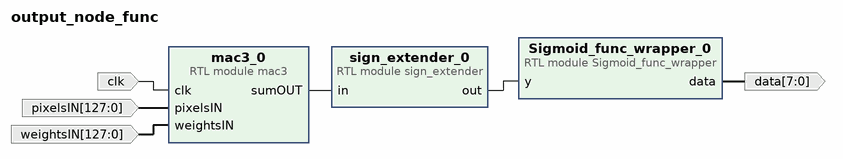
[diagram p0: block diagram of the top level]
# Vivado block design output_node_func, xc7a35tcpg236-1, Vivado 2022.2
create_bd_design output_node_func

create_bd_port -dir I -type clk clk
create_bd_port -dir I -from 127 -to 0 pixelsIN
create_bd_port -dir I -from 127 -to 0 weightsIN
create_bd_port -dir O -from 7 -to 0 data

create_bd_cell -type module -reference sign_extender sign_extender_0
create_bd_cell -type module -reference Sigmoid_func_wrapper Sigmoid_func_wrapper_0
create_bd_cell -type module -reference mac3 mac3_0

# ---- connections ----

connect_bd_net [get_bd_pins Sigmoid_func_wrapper_0/data] [get_bd_ports data]
connect_bd_net -net clk_0_1 [get_bd_ports clk] [get_bd_pins mac3_0/clk]
connect_bd_net [get_bd_pins mac3_0/sumOUT] [get_bd_pins sign_extender_0/in]
connect_bd_net -net pixelsIN_0_1 [get_bd_ports pixelsIN] [get_bd_pins mac3_0/pixelsIN]
connect_bd_net [get_bd_pins sign_extender_0/out] [get_bd_pins Sigmoid_func_wrapper_0/y]
connect_bd_net [get_bd_ports weightsIN] [get_bd_pins mac3_0/weightsIN]

validate_bd_design
save_bd_design
